# EasyEDA schematic PCB-IEDP.json
TITLE: SCH-IEDP; REV: 1.0; Date: 2025-03-15; Sheet: 1/1; Company: Your Company
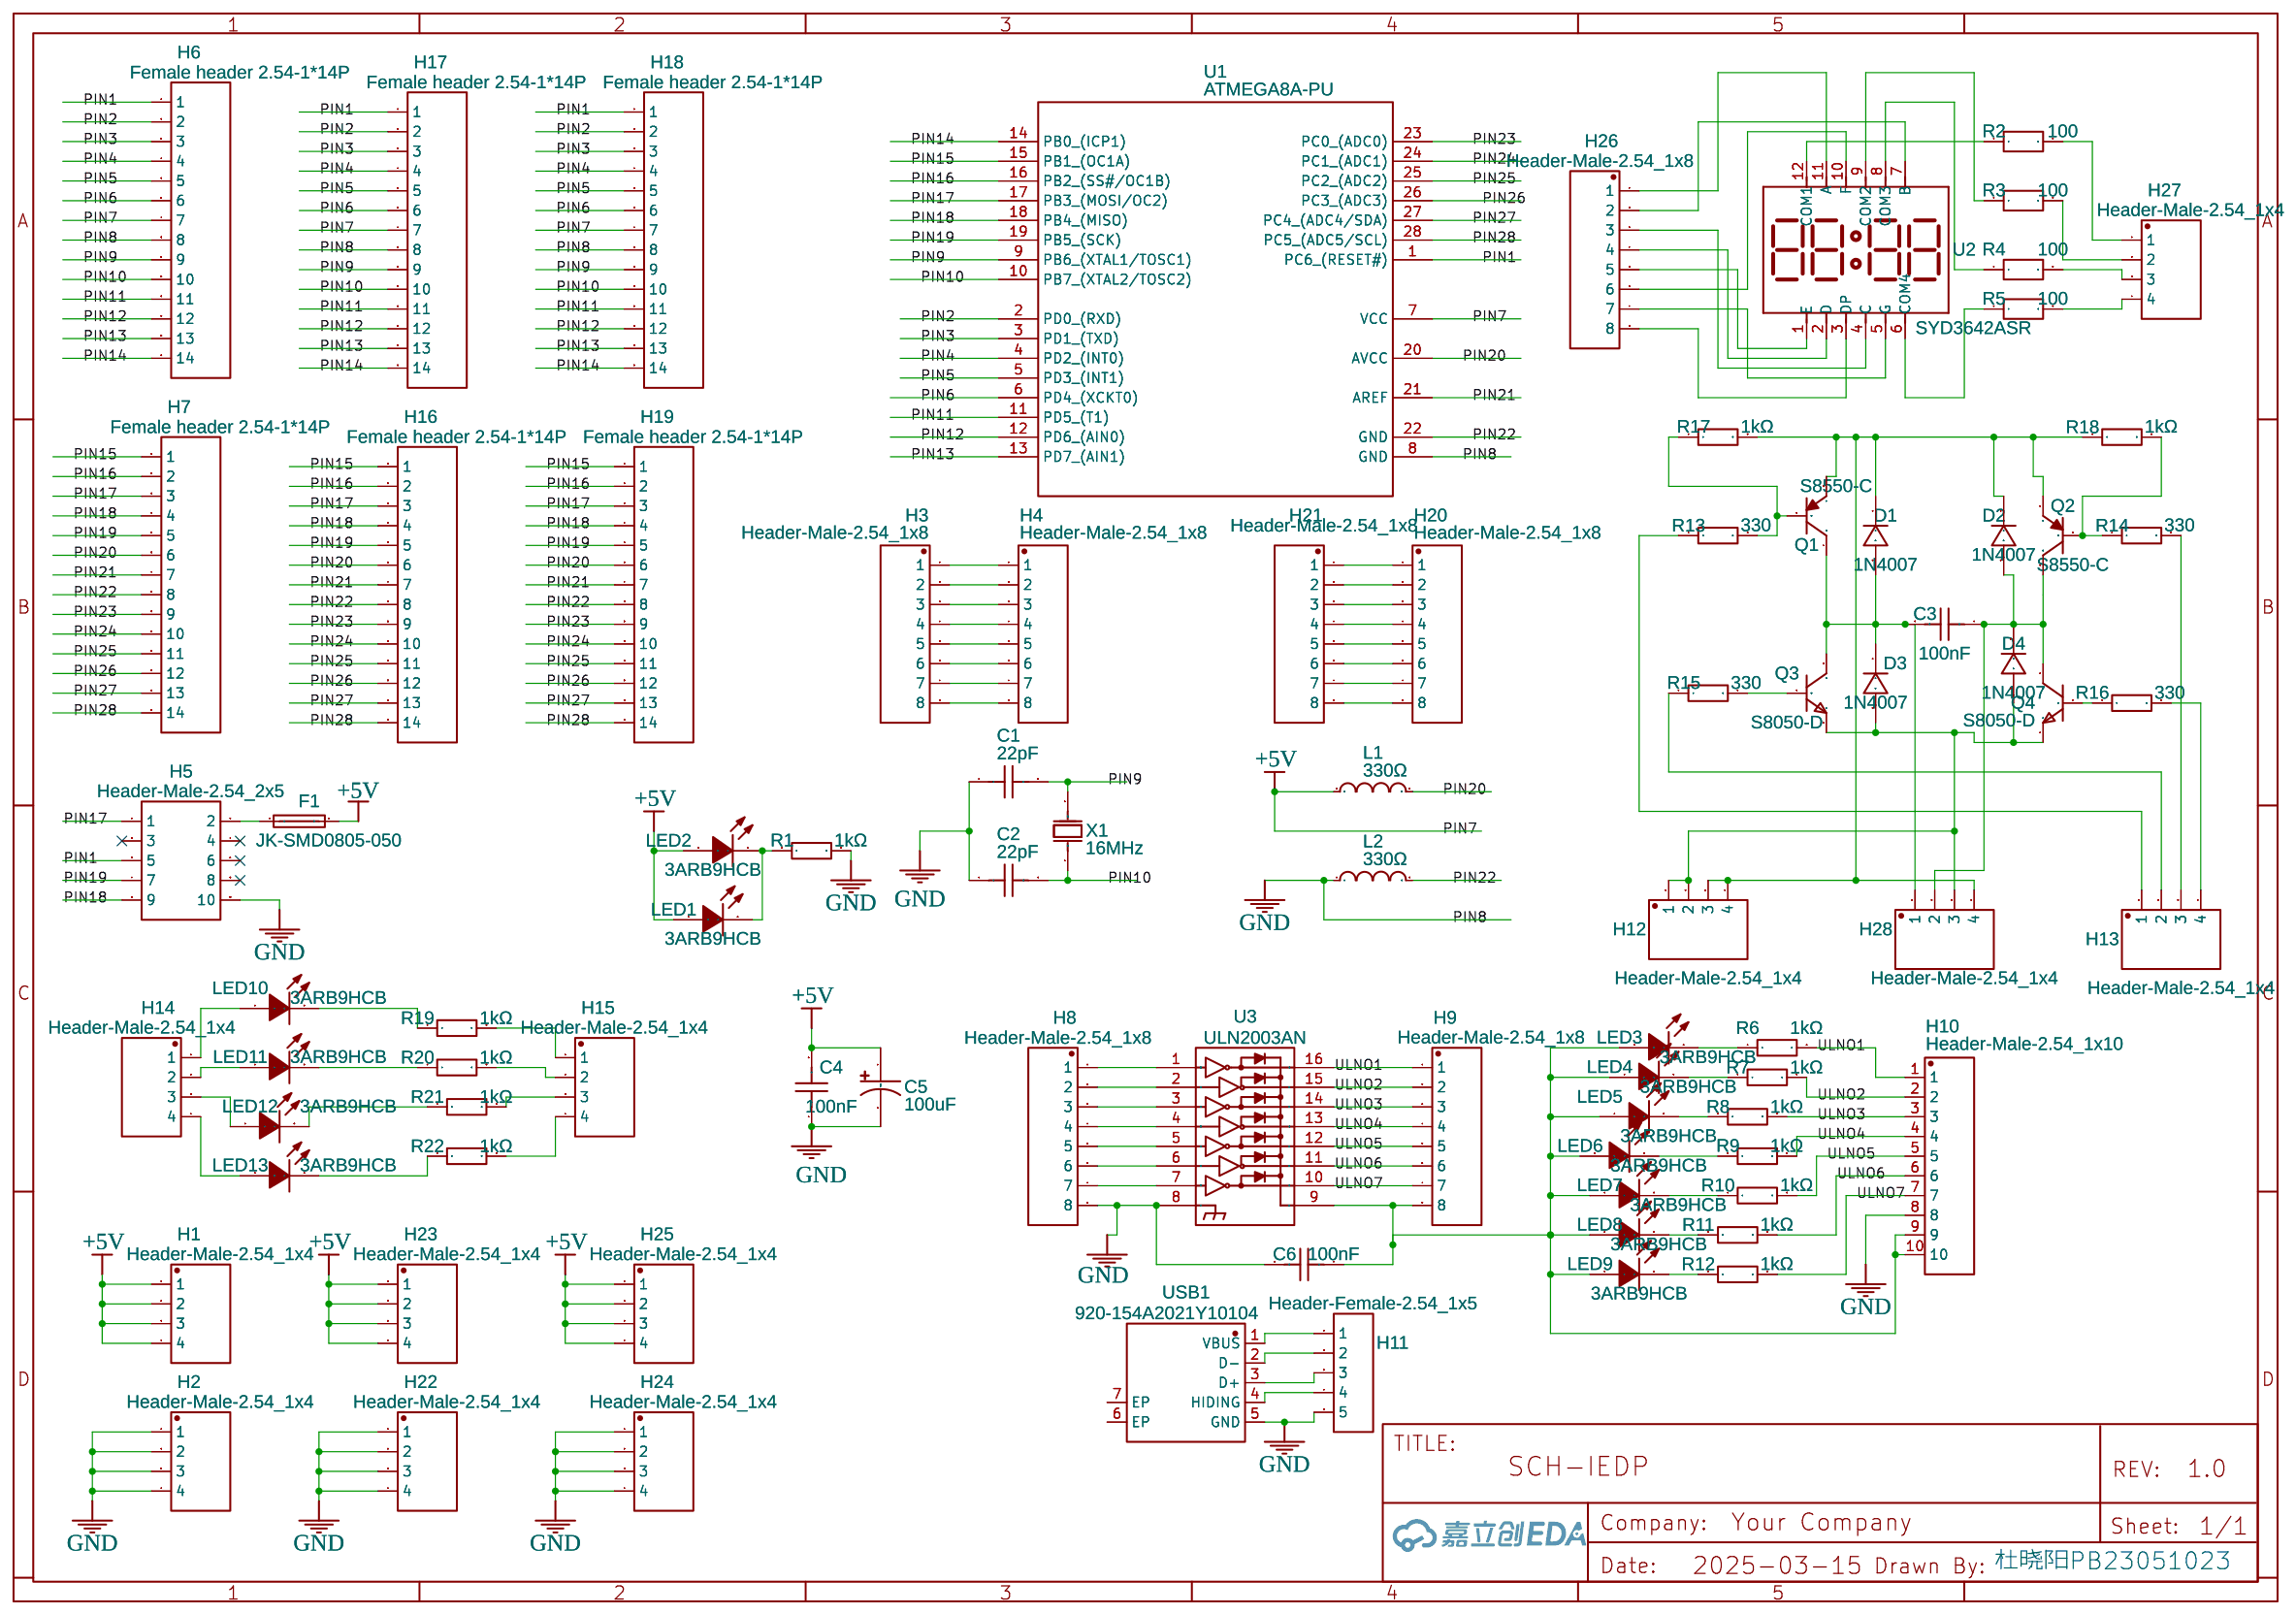
[diagram p0: schematic sheet]

## Parts
C1  22pF  [C0805]
C2  22pF  [C0805]
C3  100nF  [CAP-TH_BD2.2-L3.2-P5.08-D0.6]
C4  100nF  [CAP-TH_BD2.2-L3.2-P5.08-D0.6]
C5  100uF  [CAP-TH_BD5.0-P2.00-D0.8-FD]
C6  100nF  [CAP-TH_BD2.2-L3.2-P5.08-D0.6]
D1  1N4007  [SENSOR-TH_BD4.0-P2.54-D0.5-A]
D2  1N4007  [SENSOR-TH_BD4.0-P2.54-D0.5-A]
D3  1N4007  [SENSOR-TH_BD4.0-P2.54-D0.5-A]
D4  1N4007  [SENSOR-TH_BD4.0-P2.54-D0.5-A]
F1  JK-SMD0805-050  [F0805]
H1  Header-Male-2.54_1x4  [HDR-TH_4P-P2.54-V-M]
H2  Header-Male-2.54_1x4  [HDR-TH_4P-P2.54-V-M]
H3  Header-Male-2.54_1x8  [HDR-TH_8P-P2.54-V-M]
H4  Header-Male-2.54_1x8  [HDR-TH_8P-P2.54-V-M]
H5  Header-Male-2.54_2x5  [HDR-TH_10P-P2.54-V-M-R2-C5-S2.54]
H6  Female header 2.54-1*14P  [HDR-TH_14P-P2.54-V-F-1]
H7  Female header 2.54-1*14P  [HDR-TH_14P-P2.54-V-F-1]
H8  Header-Male-2.54_1x8  [HDR-TH_8P-P2.54-V-M]
H9  Header-Male-2.54_1x8  [HDR-TH_8P-P2.54-V-M]
H10  Header-Male-2.54_1x10  [HDR-TH_10P-P2.54-V-M-1]
H11  Header-Female-2.54_1x5  [HDR-TH_5P-P2.54-V-F]
H12  Header-Male-2.54_1x4  [HDR-TH_4P-P2.54-V-M]
H13  Header-Male-2.54_1x4  [HDR-TH_4P-P2.54-V-M]
H14  Header-Male-2.54_1x4  [HDR-TH_4P-P2.54-V-M]
H15  Header-Male-2.54_1x4  [HDR-TH_4P-P2.54-V-M]
H16  Female header 2.54-1*14P  [HDR-TH_14P-P2.54-V-F-1]
H17  Female header 2.54-1*14P  [HDR-TH_14P-P2.54-V-F-1]
H18  Female header 2.54-1*14P  [HDR-TH_14P-P2.54-V-F-1]
H19  Female header 2.54-1*14P  [HDR-TH_14P-P2.54-V-F-1]
H20  Header-Male-2.54_1x8  [HDR-TH_8P-P2.54-V-M]
H21  Header-Male-2.54_1x8  [HDR-TH_8P-P2.54-V-M]
H22  Header-Male-2.54_1x4  [HDR-TH_4P-P2.54-V-M]
H23  Header-Male-2.54_1x4  [HDR-TH_4P-P2.54-V-M]
H24  Header-Male-2.54_1x4  [HDR-TH_4P-P2.54-V-M]
H25  Header-Male-2.54_1x4  [HDR-TH_4P-P2.54-V-M]
H26  Header-Male-2.54_1x8  [HDR-TH_8P-P2.54-V-M]
H27  Header-Male-2.54_1x4  [HDR-TH_4P-P2.54-V-M]
H28  Header-Male-2.54_1x4  [HDR-TH_4P-P2.54-V-M]
L1  330Ω  [L0805]
L2  330Ω  [L0805]
LED1  3ARB9HCB  [LED0805-RD]
LED2  3ARB9HCB  [LED-3MM]
LED3  3ARB9HCB  [LED-3MM]
LED4  3ARB9HCB  [LED-3MM]
LED5  3ARB9HCB  [LED-3MM]
LED6  3ARB9HCB  [LED-3MM]
LED7  3ARB9HCB  [LED-3MM]
LED8  3ARB9HCB  [LED-3MM]
LED9  3ARB9HCB  [LED-3MM]
LED10  3ARB9HCB  [LED-3MM]
LED11  3ARB9HCB  [LED-3MM]
LED12  3ARB9HCB  [LED-3MM]
LED13  3ARB9HCB  [LED-3MM]
Q1  S8550-C  [TO-92-3_L4.6-W3.6-P1.27-L]
Q2  S8550-C  [TO-92-3_L4.6-W3.6-P1.27-L]
Q3  S8050-D  [TO-92-3_L4.9-W3.7-P1.27-L]
Q4  S8050-D  [TO-92-3_L4.9-W3.7-P1.27-L]
R1  1kΩ  [R0805]
R2  100  [RES-TH_L3.0-W2.3-P2.54-D0.5]
R3  100  [RES-TH_L3.0-W2.3-P2.54-D0.5]
R4  100  [RES-TH_L3.0-W2.3-P2.54-D0.5]
R5  100  [RES-TH_L3.0-W2.3-P2.54-D0.5]
R6  1kΩ  [RES-TH_L3.0-W2.3-P2.54-D0.5]
R7  1kΩ  [RES-TH_L3.0-W2.3-P2.54-D0.5]
R8  1kΩ  [RES-TH_L3.0-W2.3-P2.54-D0.5]
R9  1kΩ  [RES-TH_L3.0-W2.3-P2.54-D0.5]
R10  1kΩ  [RES-TH_L3.0-W2.3-P2.54-D0.5]
R11  1kΩ  [RES-TH_L3.0-W2.3-P2.54-D0.5]
R12  1kΩ  [RES-TH_L3.0-W2.3-P2.54-D0.5]
R13  330  [RES-TH_L3.0-W2.3-P2.54-D0.5]
R14  330  [RES-TH_L3.0-W2.3-P2.54-D0.5]
R15  330  [RES-TH_L3.0-W2.3-P2.54-D0.5]
R16  330  [RES-TH_L3.0-W2.3-P2.54-D0.5]
R17  1kΩ  [RES-TH_L3.0-W2.3-P2.54-D0.5]
R18  1kΩ  [RES-TH_L3.0-W2.3-P2.54-D0.5]
R19  1kΩ  [RES-TH_L3.0-W2.3-P2.54-D0.5]
R20  1kΩ  [RES-TH_L3.0-W2.3-P2.54-D0.5]
R21  1kΩ  [RES-TH_L3.0-W2.3-P2.54-D0.5]
R22  1kΩ  [RES-TH_L3.0-W2.3-P2.54-D0.5]
U1  ATMEGA8A-PU  [DIP-28_L34.6-W7.3-P2.54-LS10.2-BL]
U2  SYD3642ASR  [LCD12-2.54-30.0X14.0X7.3MM]
U3  ULN2003AN  [DIP-16_16P-L20.2-W6.6-P2.54-LS7.6-BL]
USB1  920-154A2021Y10104  [MICRO-USB-TH_MICRO-USB-A6]
X1  16MHz  [OSC-TH_L10.0-W4.5-P5.00]

## Library data of the parts
C1 C2 = 0805N220J101CT: Contributor: LCSC; Supplier: LCSC; Supplier Part: C296090; Manufacturer: Walsin(华新科); JLCPCB Part Class: Extended Part
C3 C4 C6 = ACC-B104K500P: Contributor: LCSC; Supplier: LCSC; Manufacturer: FH(风华); Manufacturer Part: ACC-B104K500P52; Supplier Part: C94703; JLCPCB Part Class: Extended Part
C5 = 25YXA100MEFC5X11: Contributor: LCSC; Supplier: LCSC; Supplier Part: C338183; Manufacturer: rubycon(红宝石); JLCPCB Part Class: Extended Part
D1-D4 = 1N4007A: Contributor: lcsc; Supplier: LCSC; Supplier Part: C5336145; Manufacturer: LRC(乐山无线电); JLCPCB Part Class: Extended Part
F1 = JK-SMD0805-050: Contributor: LCSC; Supplier: LCSC; Supplier Part: C369150; Manufacturer: JK(金科); JLCPCB Part Class: Extended Part
H1 H2 H12-H15 H22-H25 H27 H28 = Header-Male-2.54_1x4: Contributor: LCSC; Supplier: LCSC; Manufacturer: Ckmtw(灿科盟); Manufacturer Part: B-2100S04P-A110; Supplier Part: C124378; JLCPCB Part Class: Extended Part
H3 H4 H8 H9 H20 H21 H26 = Header-Male-2.54_1x8: Contributor: LCSC; Supplier: LCSC; Manufacturer: Ckmtw(灿科盟); Manufacturer Part: B-2100S08P-A110; Supplier Part: C124381; JLCPCB Part Class: Extended Part
H5 = Header-Male-2.54_2x5: Supplier: LCSC; Manufacturer Part: 2*5p排针 2.54mm; Supplier Part: C28207; JLCPCB Part Class: Extended Part; Manufacturer: null
H6 H7 H16-H19 = Female header 2.54-1*14P: Supplier: LCSC; Manufacturer: BOOMELE(博穆精密); Manufacturer Part: 2.54-1*14P母; Supplier Part: C52711
H10 = Header-Male-2.54_1x10: Supplier: LCSC; Manufacturer Part: 2.54-1*10P针; Supplier Part: C57369; JLCPCB Part Class: Extended Part; Manufacturer: BOOMELE(博穆精密)
H11 = Header-Female-2.54_1x5: Supplier: LCSC; Manufacturer: BOOMELE(博穆精密); Manufacturer Part: 2.54-1*5P母; Supplier Part: C50950; JLCPCB Part Class: Extended Part
L1 L2 = CBG201209U301T: Supplier: LCSC; Manufacturer: FH(风华); Supplier Part: C124101; JLCPCB Part Class: Extended Part
LED1-LED13 = 3ARB9HCB: Supplier: LCSC; Manufacturer: null; Supplier Part: C42016; JLCPCB Part Class: Extended Part
Q1 Q2 = S8550-C: Contributor: LCSC; Supplier: LCSC; Supplier Part: C2844047; Manufacturer: BLUE ROCKET(蓝箭); JLCPCB Part Class: Extended Part
Q3 Q4 = S8050-D: Contributor: LCSC; Supplier: LCSC; Supplier Part: C305417; Manufacturer: BLUE ROCKET(蓝箭); JLCPCB Part Class: Extended Part
R1 R6-R22 = TR0805B1KP0525: Contributor: LCSC; Supplier: LCSC; Supplier Part: C188361; Manufacturer: EVER OHMS(天二科技); Manufacturer Part: TR0805B1K00P0525Z; JLCPCB Part Class: Extended Part
R2-R5 = Y145313K0000V9L: Supplier: LCSC; Supplier Part: C1485186; Manufacturer: VISHAY(威世); JLCPCB Part Class: Extended Part; Contributor: lcsc
U1 = ATMEGA8A-PU: Supplier: LCSC; Manufacturer: MICROCHIP(美国微芯); Supplier Part: C34931; JLCPCB Part Class: Extended Part
U2 = SYD3642ASR: LED-4-BETY-7-SEG; sourceId: vdNnXwusq
U3 = ULN2003AN: Supplier: LCSC; Manufacturer: TI(德州仪器); Supplier Part: C90448; JLCPCB Part Class: Extended Part
USB1 = 920-154A2021Y10104: JLCPCB Part Class: Extended Part; Contributor: LCSC; Supplier: LCSC; Supplier Part: C2763112; Manufacturer: 精拓金
X1 = X49SD16MSD2SC: Supplier: LCSC; Manufacturer: YXC(扬兴晶振); Supplier Part: C16212; JLCPCB Part Class: Extended Part

## Nets
+5V: C4.2 C5.1 F1.2 H1.1 H1.2 H1.3 H1.4 H6.7 H17.7 H18.7 H23.1 H23.2 H23.3 H23.4 H25.1 H25.2 H25.3 H25.4 L1.1 LED1.1(A) LED2.1(A) U1.7(VCC)
GND: C1.1 C2.1 C4.1 C5.2 C6.2 H2.1 H2.2 H2.3 H2.4 H5.10 H6.8 H8.8 H10.8 H11.5 H17.8 H18.8 H22.1 H22.2 H22.3 H22.4 H24.1 H24.2 H24.3 H24.4 L2.1 R1.2 U1.8(GND) U3.8(E) USB1.5(GND)
PIN1: H5.5 H6.1 H17.1 H18.1 U1.1(PC6 (RESET#))
PIN2: H6.2 H17.2 H18.2 U1.2(PD0 (RXD))
PIN3: H6.3 H17.3 H18.3 U1.3(PD1 (TXD))
PIN4: H6.4 H17.4 H18.4 U1.4(PD2 (INT0))
PIN5: H6.5 H17.5 H18.5 U1.5(PD3 (INT1))
PIN6: H6.6 H17.6 H18.6 U1.6(PD4 (XCKT0))
PIN9: C1.2 H6.9 H17.9 H18.9 U1.9(PB6 (XTAL1/TOSC1)) X1.2(OSC2)
PIN10: C2.2 H6.10 H17.10 H18.10 U1.10(PB7 (XTAL2/TOSC2)) X1.1(OSC1)
PIN11: H6.11 H17.11 H18.11 U1.11(PD5 (T1))
PIN12: H6.12 H17.12 H18.12 U1.12(PD6 (AIN0))
PIN13: H6.13 H17.13 H18.13 U1.13(PD7 (AIN1))
PIN14: H6.14 H17.14 H18.14 U1.14(PB0 (ICP1))
PIN15: H7.1 H16.1 H19.1 U1.15(PB1 (OC1A))
PIN16: H7.2 H16.2 H19.2 U1.16(PB2 (SS#/OC1B))
PIN17: H5.1 H7.3 H16.3 H19.3 U1.17(PB3 (MOSI/OC2))
PIN18: H5.9 H7.4 H16.4 H19.4 U1.18(PB4 (MISO))
PIN19: H5.7 H7.5 H16.5 H19.5 U1.19(PB5 (SCK))
PIN20: H7.6 H16.6 H19.6 L1.2 U1.20(AVCC)
PIN21: H7.7 H16.7 H19.7 U1.21(AREF)
PIN22: H7.8 H16.8 H19.8 L2.2 U1.22(GND)
PIN23: H7.9 H16.9 H19.9 U1.23(PC0 (ADC0))
PIN24: H7.10 H16.10 H19.10 U1.24(PC1 (ADC1))
PIN25: H7.11 H16.11 H19.11 U1.25(PC2 (ADC2))
PIN26: H7.12 H16.12 H19.12 U1.26(PC3 (ADC3))
PIN27: H7.13 H16.13 H19.13 U1.27(PC4 (ADC4/SDA))
PIN28: H7.14 H16.14 H19.14 U1.28(PC5 (ADC5/SCL))
ULNO1: H9.1 H10.1 R6.2 U3.16(1C)
ULNO2: H9.2 H10.2 R7.2 U3.15(2C)
ULNO3: H9.3 H10.3 R8.2 U3.14(3C)
ULNO4: H9.4 H10.4 R9.2 U3.13(4C)
ULNO5: H9.5 H10.5 R10.2 U3.12(5C)
ULNO6: H9.6 H10.6 R11.2 U3.11(6C)
ULNO7: H9.7 H10.7 R12.2 U3.10(7C)
Net-(C3-1): C3.1 D2.2 D4.1 H28.2 Q2.1(C) Q4.3(C)
Net-(C3-2): C3.2 D1.2 D3.1 H28.1 Q1.1(C) Q3.3(C)
Net-(C6-1): C6.1 H9.8 H10.9 H10.10 LED3.1(A) LED4.1(A) LED5.1(A) LED6.1(A) LED7.1(A) LED8.1(A) LED9.1(A) U3.9(COM)
Net-(D1-1): D1.1 D2.1 H12.3 H12.4 H28.4 Q1.3(E) Q2.3(E) R17.2 R18.1
Net-(D3-2): D3.2 D4.2 H12.1 H12.2 H28.3 Q3.1(E) Q4.1(E)
Net-(F1-1): F1.1 H5.2
Net-(H3-1): H3.1 H4.1
Net-(H3-2): H3.2 H4.2
Net-(H3-3): H3.3 H4.3
Net-(H3-4): H3.4 H4.4
Net-(H3-5): H3.5 H4.5
Net-(H3-6): H3.6 H4.6
Net-(H3-7): H3.7 H4.7
Net-(H3-8): H3.8 H4.8
Net-(H8-1): H8.1 U3.1(1B)
Net-(H8-2): H8.2 U3.2(2B)
Net-(H8-3): H8.3 U3.3(3B)
Net-(H8-4): H8.4 U3.4(4B)
Net-(H8-5): H8.5 U3.5(5B)
Net-(H8-6): H8.6 U3.6(6B)
Net-(H8-7): H8.7 U3.7(7B)
Net-(H11-1): H11.1 USB1.1(VBUS)
Net-(H11-2): H11.2 USB1.2(D-)
Net-(H11-3): H11.3 USB1.3(D+)
Net-(H11-4): H11.4 USB1.4(HIDING)
Net-(H13-1): H13.1 R13.1
Net-(H13-2): H13.2 R15.1
Net-(H13-3): H13.3 R14.2
Net-(H13-4): H13.4 R16.2
Net-(H14-1): H14.1 LED10.1(A)
Net-(H14-2): H14.2 LED11.1(A)
Net-(H14-3): H14.3 LED12.1(A)
Net-(H14-4): H14.4 LED13.1(A)
Net-(H15-1): H15.1 R19.2
Net-(H15-2): H15.2 R20.2
Net-(H15-3): H15.3 R21.2
Net-(H15-4): H15.4 R22.2
Net-(H20-1): H20.1 H21.1
Net-(H20-2): H20.2 H21.2
Net-(H20-3): H20.3 H21.3
Net-(H20-4): H20.4 H21.4
Net-(H20-5): H20.5 H21.5
Net-(H20-6): H20.6 H21.6
Net-(H20-7): H20.7 H21.7
Net-(H20-8): H20.8 H21.8
Net-(H26-1): H26.1 U2.11(A)
Net-(H26-2): H26.2 U2.7(B)
Net-(H26-3): H26.3 U2.4(C)
Net-(H26-4): H26.4 U2.2(D)
Net-(H26-5): H26.5 U2.1(E)
Net-(H26-6): H26.6 U2.10(F)
Net-(H26-7): H26.7 U2.5(G)
Net-(H26-8): H26.8 U2.3(DP)
Net-(H27-1): H27.1 R2.2
Net-(H27-2): H27.2 R3.2
Net-(H27-3): H27.3 R4.2
Net-(H27-4): H27.4 R5.2
Net-(LED1-2): LED1.2(K) LED2.2(K) R1.1
Net-(LED3-2): LED3.2(K) R6.1
Net-(LED4-2): LED4.2(K) R7.1
Net-(LED5-2): LED5.2(K) R8.1
Net-(LED6-2): LED6.2(K) R9.1
Net-(LED7-2): LED7.2(K) R10.1
Net-(LED8-2): LED8.2(K) R11.1
Net-(LED9-2): LED9.2(K) R12.1
Net-(LED10-2): LED10.2(K) R19.1
Net-(LED11-2): LED11.2(K) R20.1
Net-(LED12-2): LED12.2(K) R21.1
Net-(LED13-2): LED13.2(K) R22.1
Net-(Q1-2): Q1.2(B) R13.2 R17.1
Net-(Q2-2): Q2.2(B) R14.1 R18.2
Net-(Q3-2): Q3.2(B) R15.2
Net-(Q4-2): Q4.2(B) R16.1
Net-(R2-1): R2.1 U2.12(COM1)
Net-(R3-1): R3.1 U2.9(COM2)
Net-(R4-1): R4.1 U2.8(COM3)
Net-(R5-1): R5.1 U2.6(COM4)

Not connected (* = marked no-connect by the designer): H5 3* 4* 6* 8*; USB1 6(EP) 7(EP)

## Notes on the sheet
- 杜晓阳PB23051023
